# Altium schematic sheet switches.SchDoc
size D
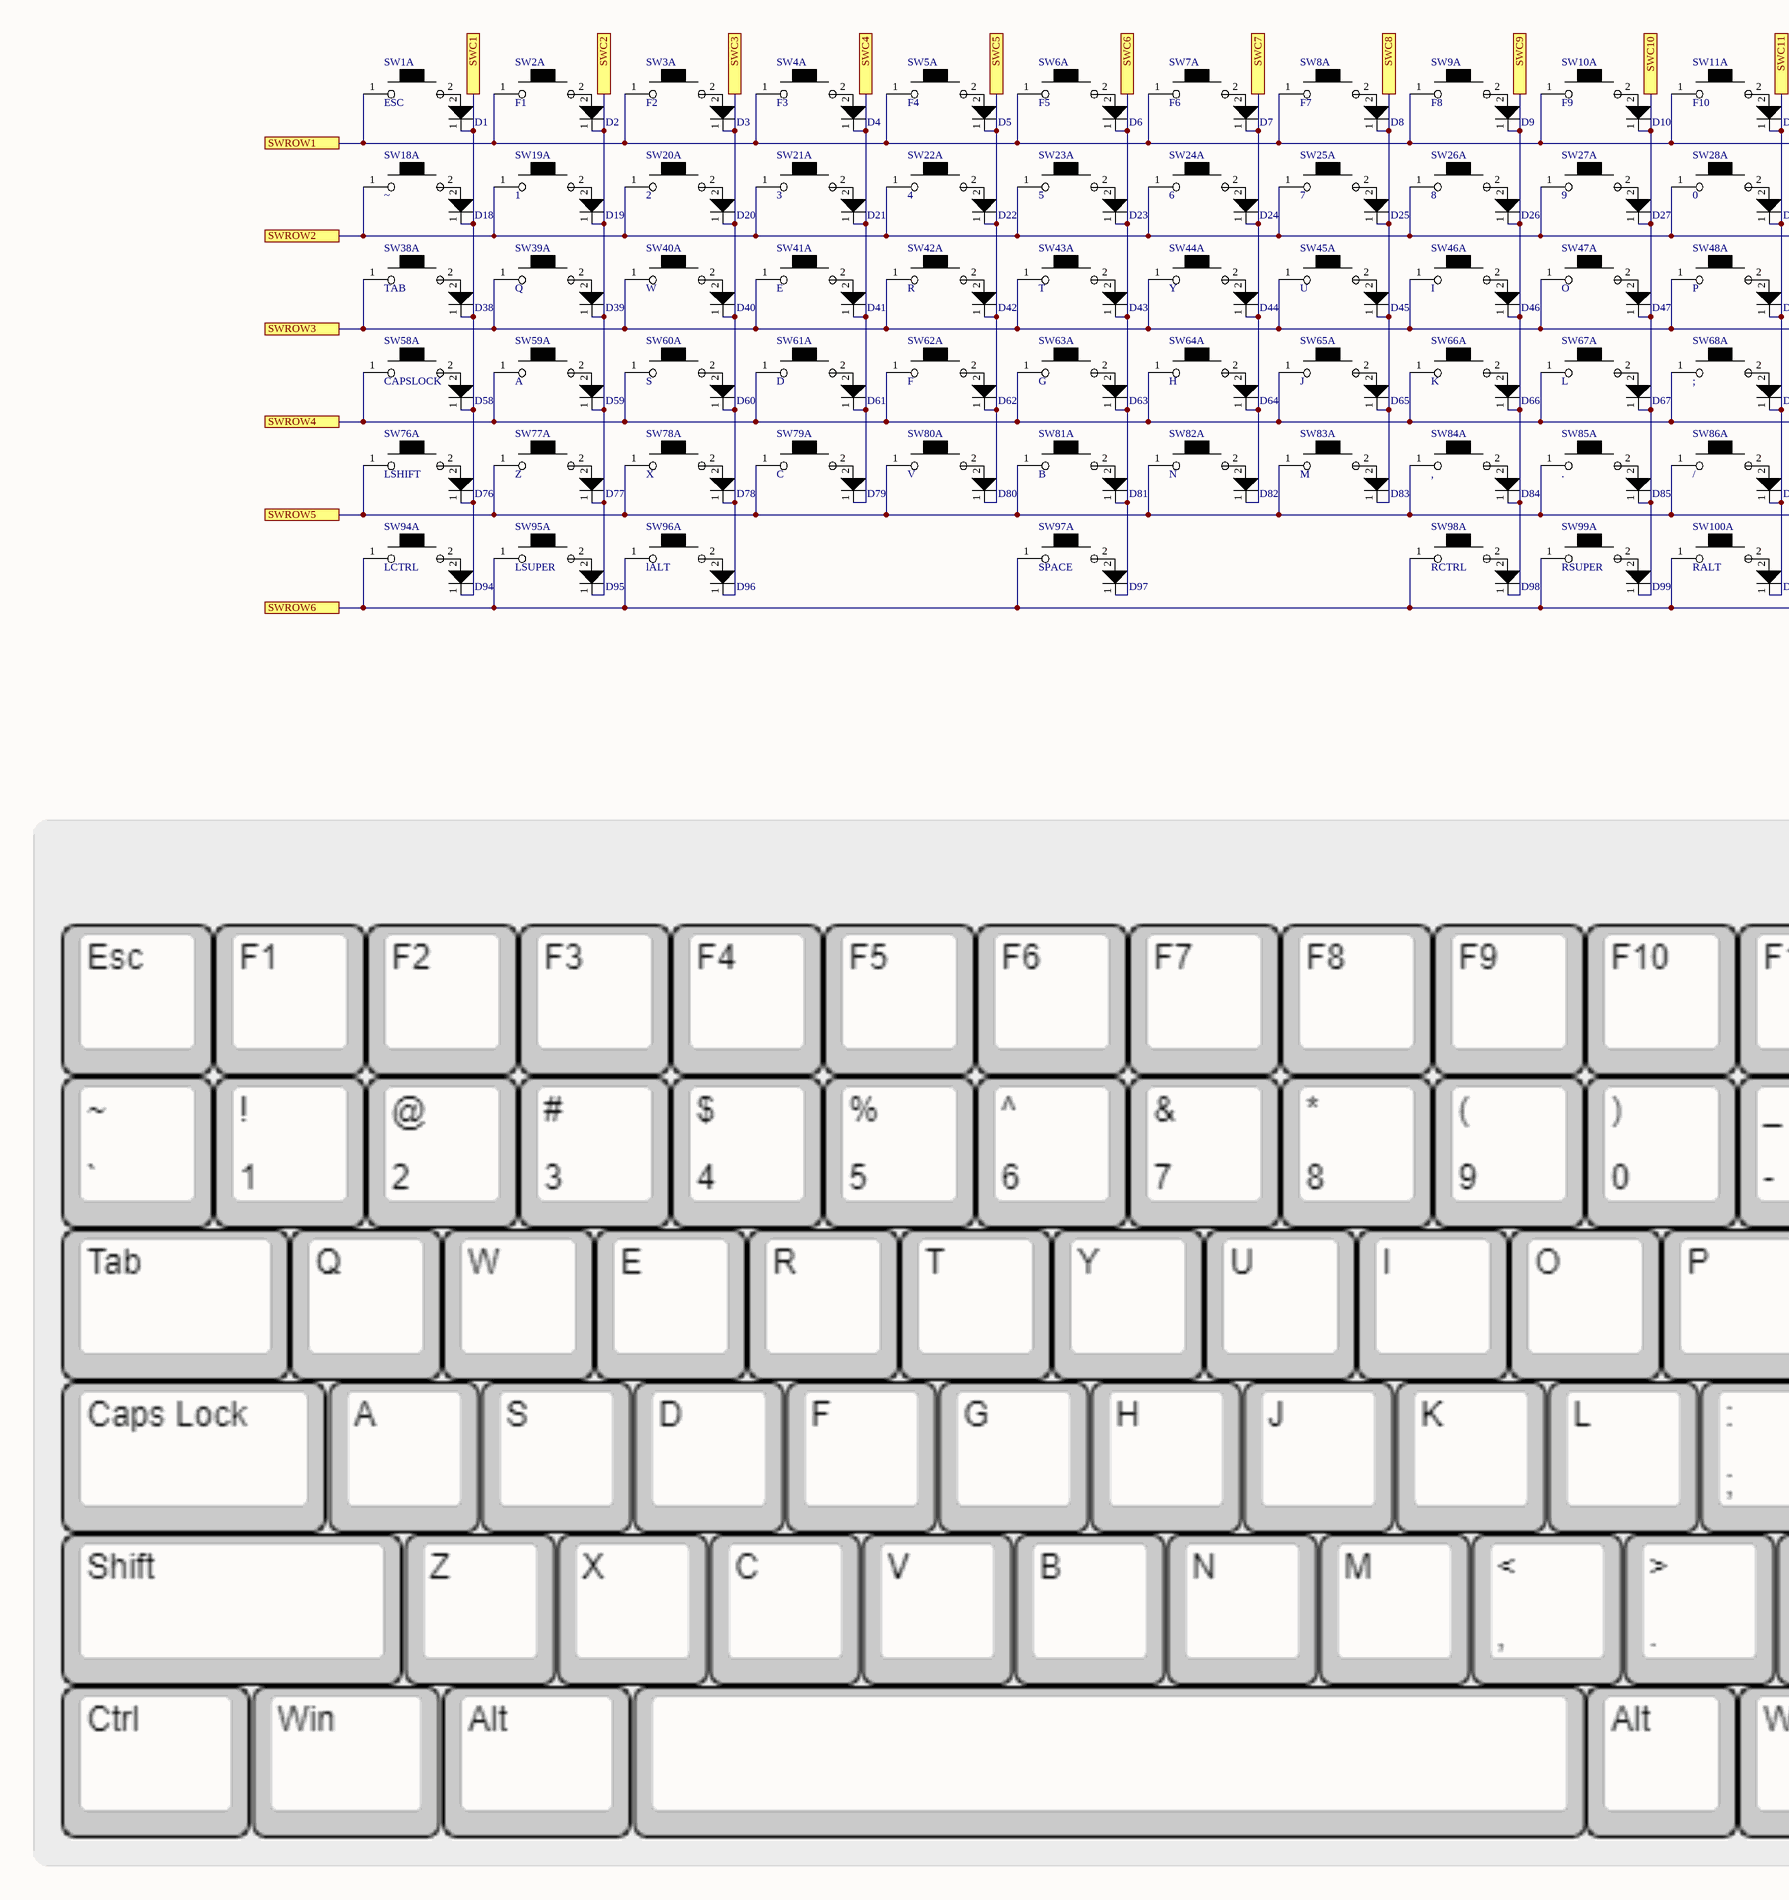
[diagram p0: switches.SchDoc, left]
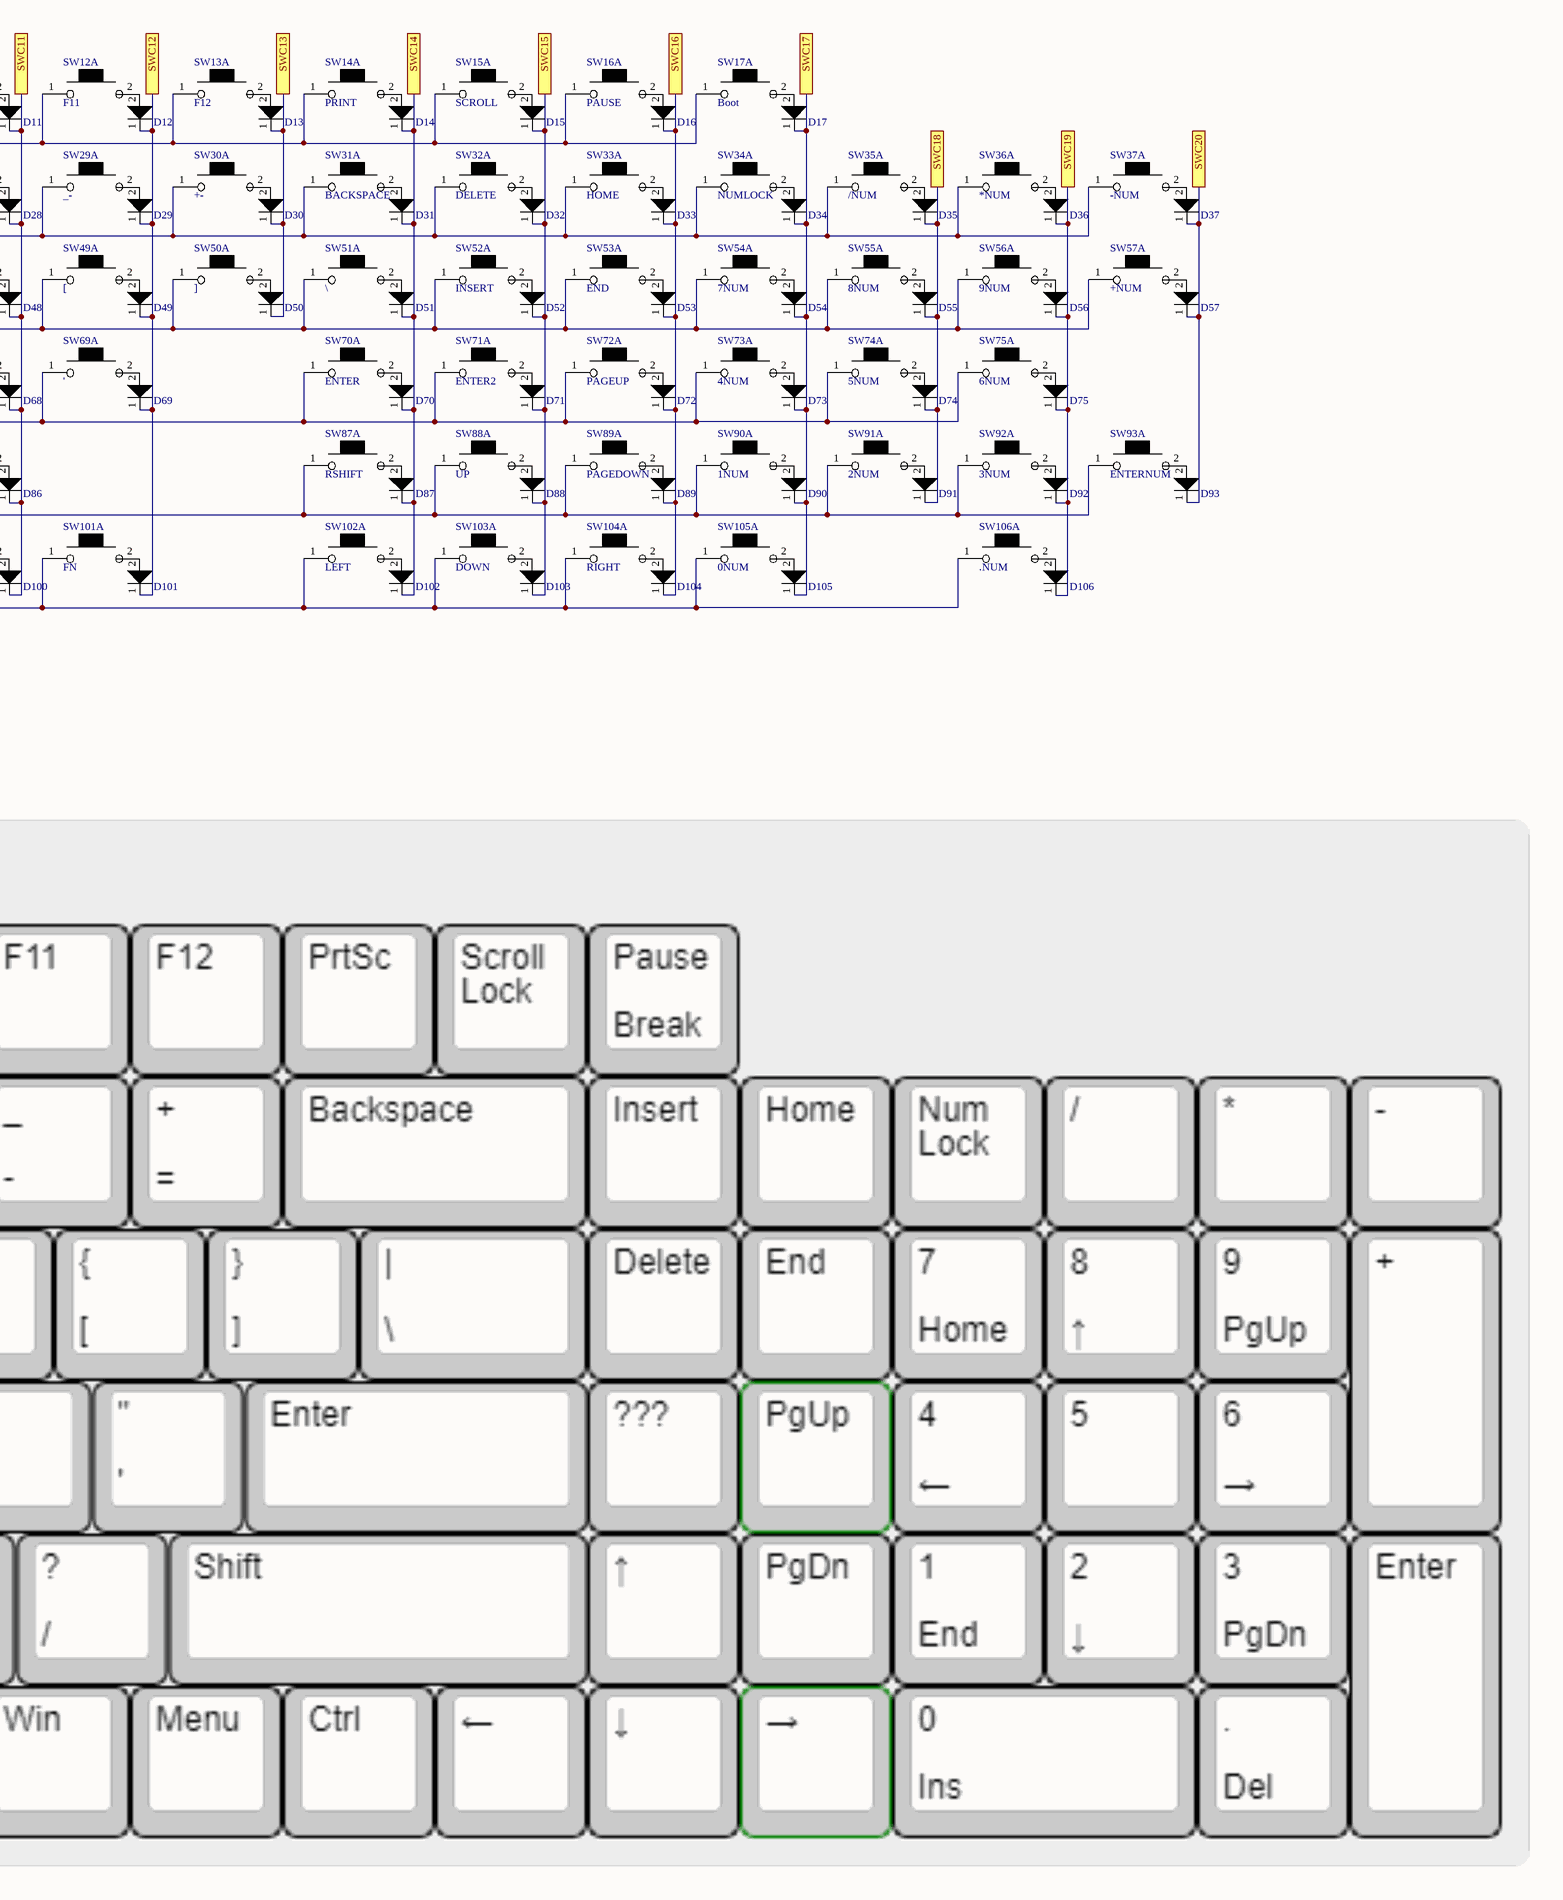
[diagram p1: switches.SchDoc, right]

## Parts
D1  1N4148WTR  [SOD-123]  (value not drawn)
D2  1N4148WTR  [SOD-123]  (value not drawn)
D3  1N4148WTR  [SOD-123]  (value not drawn)
D4  1N4148WTR  [SOD-123]  (value not drawn)
D5  1N4148WTR  [SOD-123]  (value not drawn)
D6  1N4148WTR  [SOD-123]  (value not drawn)
D7  1N4148WTR  [SOD-123]  (value not drawn)
D8  1N4148WTR  [SOD-123]  (value not drawn)
D9  1N4148WTR  [SOD-123]  (value not drawn)
D10  1N4148WTR  [SOD-123]  (value not drawn)
D11  1N4148WTR  [SOD-123]  (value not drawn)
D12  1N4148WTR  [SOD-123]  (value not drawn)
D13  1N4148WTR  [SOD-123]  (value not drawn)
D14  1N4148WTR  [SOD-123]  (value not drawn)
D15  1N4148WTR  [SOD-123]  (value not drawn)
D16  1N4148WTR  [SOD-123]  (value not drawn)
D17  1N4148WTR  [SOD-123]  (value not drawn)
D18  1N4148WTR  [SOD-123]  (value not drawn)
D19  1N4148WTR  [SOD-123]  (value not drawn)
D20  1N4148WTR  [SOD-123]  (value not drawn)
D21  1N4148WTR  [SOD-123]  (value not drawn)
D22  1N4148WTR  [SOD-123]  (value not drawn)
D23  1N4148WTR  [SOD-123]  (value not drawn)
D24  1N4148WTR  [SOD-123]  (value not drawn)
D25  1N4148WTR  [SOD-123]  (value not drawn)
D26  1N4148WTR  [SOD-123]  (value not drawn)
D27  1N4148WTR  [SOD-123]  (value not drawn)
D28  1N4148WTR  [SOD-123]  (value not drawn)
D29  1N4148WTR  [SOD-123]  (value not drawn)
D30  1N4148WTR  [SOD-123]  (value not drawn)
D31  1N4148WTR  [SOD-123]  (value not drawn)
D32  1N4148WTR  [SOD-123]  (value not drawn)
D33  1N4148WTR  [SOD-123]  (value not drawn)
D34  1N4148WTR  [SOD-123]  (value not drawn)
D35  1N4148WTR  [SOD-123]  (value not drawn)
D36  1N4148WTR  [SOD-123]  (value not drawn)
D37  1N4148WTR  [SOD-123]  (value not drawn)
D38  1N4148WTR  [SOD-123]  (value not drawn)
D39  1N4148WTR  [SOD-123]  (value not drawn)
D40  1N4148WTR  [SOD-123]  (value not drawn)
D41  1N4148WTR  [SOD-123]  (value not drawn)
D42  1N4148WTR  [SOD-123]  (value not drawn)
D43  1N4148WTR  [SOD-123]  (value not drawn)
D44  1N4148WTR  [SOD-123]  (value not drawn)
D45  1N4148WTR  [SOD-123]  (value not drawn)
D46  1N4148WTR  [SOD-123]  (value not drawn)
D47  1N4148WTR  [SOD-123]  (value not drawn)
D48  1N4148WTR  [SOD-123]  (value not drawn)
D49  1N4148WTR  [SOD-123]  (value not drawn)
D50  1N4148WTR  [SOD-123]  (value not drawn)
D51  1N4148WTR  [SOD-123]  (value not drawn)
D52  1N4148WTR  [SOD-123]  (value not drawn)
D53  1N4148WTR  [SOD-123]  (value not drawn)
D54  1N4148WTR  [SOD-123]  (value not drawn)
D55  1N4148WTR  [SOD-123]  (value not drawn)
D56  1N4148WTR  [SOD-123]  (value not drawn)
D57  1N4148WTR  [SOD-123]  (value not drawn)
D58  1N4148WTR  [SOD-123]  (value not drawn)
D59  1N4148WTR  [SOD-123]  (value not drawn)
D60  1N4148WTR  [SOD-123]  (value not drawn)
D61  1N4148WTR  [SOD-123]  (value not drawn)
D62  1N4148WTR  [SOD-123]  (value not drawn)
D63  1N4148WTR  [SOD-123]  (value not drawn)
D64  1N4148WTR  [SOD-123]  (value not drawn)
D65  1N4148WTR  [SOD-123]  (value not drawn)
D66  1N4148WTR  [SOD-123]  (value not drawn)
D67  1N4148WTR  [SOD-123]  (value not drawn)
D68  1N4148WTR  [SOD-123]  (value not drawn)
D69  1N4148WTR  [SOD-123]  (value not drawn)
D70  1N4148WTR  [SOD-123]  (value not drawn)
D71  1N4148WTR  [SOD-123]  (value not drawn)
D72  1N4148WTR  [SOD-123]  (value not drawn)
D73  1N4148WTR  [SOD-123]  (value not drawn)
D74  1N4148WTR  [SOD-123]  (value not drawn)
D75  1N4148WTR  [SOD-123]  (value not drawn)
D76  1N4148WTR  [SOD-123]  (value not drawn)
D77  1N4148WTR  [SOD-123]  (value not drawn)
D78  1N4148WTR  [SOD-123]  (value not drawn)
D79  1N4148WTR  [SOD-123]  (value not drawn)
D80  1N4148WTR  [SOD-123]  (value not drawn)
D81  1N4148WTR  [SOD-123]  (value not drawn)
D82  1N4148WTR  [SOD-123]  (value not drawn)
D83  1N4148WTR  [SOD-123]  (value not drawn)
D84  1N4148WTR  [SOD-123]  (value not drawn)
D85  1N4148WTR  [SOD-123]  (value not drawn)
D86  1N4148WTR  [SOD-123]  (value not drawn)
D87  1N4148WTR  [SOD-123]  (value not drawn)
D88  1N4148WTR  [SOD-123]  (value not drawn)
D89  1N4148WTR  [SOD-123]  (value not drawn)
D90  1N4148WTR  [SOD-123]  (value not drawn)
D91  1N4148WTR  [SOD-123]  (value not drawn)
D92  1N4148WTR  [SOD-123]  (value not drawn)
D93  1N4148WTR  [SOD-123]  (value not drawn)
D94  1N4148WTR  [SOD-123]  (value not drawn)
D95  1N4148WTR  [SOD-123]  (value not drawn)
D96  1N4148WTR  [SOD-123]  (value not drawn)
D97  1N4148WTR  [SOD-123]  (value not drawn)
D98  1N4148WTR  [SOD-123]  (value not drawn)
D99  1N4148WTR  [SOD-123]  (value not drawn)
D100  1N4148WTR  [SOD-123]  (value not drawn)
D101  1N4148WTR  [SOD-123]  (value not drawn)
D102  1N4148WTR  [SOD-123]  (value not drawn)
D103  1N4148WTR  [SOD-123]  (value not drawn)
D104  1N4148WTR  [SOD-123]  (value not drawn)
D105  1N4148WTR  [SOD-123]  (value not drawn)
D106  1N4148WTR  [SOD-123]  (value not drawn)
SW1  ESC  [SWITCH_U1_W_LED]  (part A of 2)
SW2  F1  [SWITCH_U1_W_LED]  (part A of 2)
SW3  F2  [SWITCH_U1_W_LED]  (part A of 2)
SW4  F3  [SWITCH_U1_W_LED]  (part A of 2)
SW5  F4  [SWITCH_U1_W_LED]  (part A of 2)
SW6  F5  [SWITCH_U1_W_LED]  (part A of 2)
SW7  F6  [SWITCH_U1_W_LED]  (part A of 2)
SW8  F7  [SWITCH_U1_W_LED]  (part A of 2)
SW9  F8  [SWITCH_U1_W_LED]  (part A of 2)
SW10  F9  [SWITCH_U1_W_LED]  (part A of 2)
SW11  F10  [SWITCH_U1_W_LED]  (part A of 2)
SW12  F11  [SWITCH_U1_W_LED]  (part A of 2)
SW13  F12  [SWITCH_U1_W_LED]  (part A of 2)
SW14  PRINT  [SWITCH_U1_W_LED]  (part A of 2)
SW15  SCROLL  [SWITCH_U1_W_LED]  (part A of 2)
SW16  PAUSE  [SWITCH_U1_W_LED]  (part A of 2)
SW17  Boot  [SWITCH_U1_W_LED]  (part A of 2)
SW18  ~  [SWITCH_U1_W_LED]  (part A of 2)
SW19  1  [SWITCH_U1_W_LED]  (part A of 2)
SW20  2  [SWITCH_U1_W_LED]  (part A of 2)
SW21  3  [SWITCH_U1_W_LED]  (part A of 2)
SW22  4  [SWITCH_U1_W_LED]  (part A of 2)
SW23  5  [SWITCH_U1_W_LED]  (part A of 2)
SW24  6  [SWITCH_U1_W_LED]  (part A of 2)
SW25  7  [SWITCH_U1_W_LED]  (part A of 2)
SW26  8  [SWITCH_U1_W_LED]  (part A of 2)
SW27  9  [SWITCH_U1_W_LED]  (part A of 2)
SW28  0  [SWITCH_U1_W_LED]  (part A of 2)
SW29  _-  [SWITCH_U1_W_LED]  (part A of 2)
SW30  +-  [SWITCH_U1_W_LED]  (part A of 2)
SW31  BACKSPACE  [SWITCH_U2_W_LED]  (part A of 2)
SW32  DELETE  [SWITCH_U1_W_LED]  (part A of 2)
SW33  HOME  [SWITCH_U1_W_LED]  (part A of 2)
SW34  NUMLOCK  [SWITCH_U1_W_LED]  (part A of 2)
SW35  /NUM  [SWITCH_U1_W_LED]  (part A of 2)
SW36  *NUM  [SWITCH_U1_W_LED]  (part A of 2)
SW37  -NUM  [SWITCH_U1_W_LED]  (part A of 2)
SW38  TAB  [SWITCH_U1.50_W_LED]  (part A of 2)
SW39  Q  [SWITCH_U1_W_LED]  (part A of 2)
SW40  W  [SWITCH_U1_W_LED]  (part A of 2)
SW41  E  [SWITCH_U1_W_LED]  (part A of 2)
SW42  R  [SWITCH_U1_W_LED]  (part A of 2)
SW43  T  [SWITCH_U1_W_LED]  (part A of 2)
SW44  Y  [SWITCH_U1_W_LED]  (part A of 2)
SW45  U  [SWITCH_U1_W_LED]  (part A of 2)
SW46  I  [SWITCH_U1_W_LED]  (part A of 2)
SW47  O  [SWITCH_U1_W_LED]  (part A of 2)
SW48  P  [SWITCH_U1_W_LED]  (part A of 2)
SW49  [  [SWITCH_U1_W_LED]  (part A of 2)
SW50  ]  [SWITCH_U1_W_LED]  (part A of 2)
SW51  \  [SWITCH_U1.50_W_LED]  (part A of 2)
SW52  INSERT  [SWITCH_U1_W_LED]  (part A of 2)
SW53  END  [SWITCH_U1_W_LED]  (part A of 2)
SW54  7NUM  [SWITCH_U1_W_LED]  (part A of 2)
SW55  8NUM  [SWITCH_U1_W_LED]  (part A of 2)
SW56  9NUM  [SWITCH_U1_W_LED]  (part A of 2)
SW57  +NUM  [SWITCH_U2_W_LED - vert]  (part A of 2)
SW58  CAPSLOCK  [SWITCH_U1.75_W_LED]  (part A of 2)
SW59  A  [SWITCH_U1_W_LED]  (part A of 2)
SW60  S  [SWITCH_U1_W_LED]  (part A of 2)
SW61  D  [SWITCH_U1_W_LED]  (part A of 2)
SW62  F  [SWITCH_U1_W_LED]  (part A of 2)
SW63  G  [SWITCH_U1_W_LED]  (part A of 2)
SW64  H  [SWITCH_U1_W_LED]  (part A of 2)
SW65  J  [SWITCH_U1_W_LED]  (part A of 2)
SW66  K  [SWITCH_U1_W_LED]  (part A of 2)
SW67  L  [SWITCH_U1_W_LED]  (part A of 2)
SW68  ;  [SWITCH_U1_W_LED]  (part A of 2)
SW69  '  [SWITCH_U1_W_LED]  (part A of 2)
SW70  ENTER  [SWITCH_U2.25_W_LED]  (part A of 2)
SW71  ENTER2  [SWITCH_U1_W_LED]  (part A of 2)
SW72  PAGEUP  [SWITCH_U1_W_LED]  (part A of 2)
SW73  4NUM  [SWITCH_U1_W_LED]  (part A of 2)
SW74  5NUM  [SWITCH_U1_W_LED]  (part A of 2)
SW75  6NUM  [SWITCH_U1_W_LED]  (part A of 2)
SW76  LSHIFT  [SWITCH_U2.25_W_LED]  (part A of 2)
SW77  Z  [SWITCH_U1_W_LED]  (part A of 2)
SW78  X  [SWITCH_U1_W_LED]  (part A of 2)
SW79  C  [SWITCH_U1_W_LED]  (part A of 2)
SW80  V  [SWITCH_U1_W_LED]  (part A of 2)
SW81  B  [SWITCH_U1_W_LED]  (part A of 2)
SW82  N  [SWITCH_U1_W_LED]  (part A of 2)
SW83  M  [SWITCH_U1_W_LED]  (part A of 2)
SW84  ,  [SWITCH_U1_W_LED]  (part A of 2)
SW85  .  [SWITCH_U1_W_LED]  (part A of 2)
SW86  /  [SWITCH_U1_W_LED]  (part A of 2)
SW87  RSHIFT  [SWITCH_U2.75_W_LED]  (part A of 2)
SW88  UP  [SWITCH_U1_W_LED]  (part A of 2)
SW89  PAGEDOWN  [SWITCH_U1_W_LED]  (part A of 2)
SW90  1NUM  [SWITCH_U1_W_LED]  (part A of 2)
SW91  2NUM  [SWITCH_U1_W_LED]  (part A of 2)
SW92  3NUM  [SWITCH_U1_W_LED]  (part A of 2)
SW93  ENTERNUM  [SWITCH_U2_W_LED - vert]  (part A of 2)
SW94  LCTRL  [SWITCH_U1.25_W_LED]  (part A of 2)
SW95  LSUPER  [SWITCH_U1.25_W_LED]  (part A of 2)
SW96  lALT  [SWITCH_U1.25_W_LED]  (part A of 2)
SW97  SPACE  [SWITCH_U6.25_W_LED - duplicate]  (part A of 2)
SW98  RCTRL  [SWITCH_U1_W_LED]  (part A of 2)
SW99  RSUPER  [SWITCH_U1_W_LED]  (part A of 2)
SW100  RALT  [SWITCH_U1_W_LED]  (part A of 2)
SW101  FN  [SWITCH_U1_W_LED]  (part A of 2)
SW102  LEFT  [SWITCH_U1_W_LED]  (part A of 2)
SW103  DOWN  [SWITCH_U1_W_LED]  (part A of 2)
SW104  RIGHT  [SWITCH_U1_W_LED]  (part A of 2)
SW105  0NUM  [SWITCH_U2_W_LED]  (part A of 2)
SW106  .NUM  [SWITCH_U1_W_LED]  (part A of 2)

## Ports
SWC1, SWC2, SWC3, SWC4, SWC5, SWC6, SWC7, SWC8, SWC9, SWC10, SWC11, SWC12, SWC13, SWC14, SWC15, SWC16, SWC17, SWC18, SWC19, SWC20, SWROW1, SWROW2, SWROW3, SWROW4, SWROW5, SWROW6

## Nets
SWC1: D1.1 D18.1 D38.1 D58.1 D76.1 D94.1 ; port SWC1
SWC2: D2.1 D19.1 D39.1 D59.1 D77.1 D95.1 ; port SWC2
SWC3: D3.1 D20.1 D40.1 D60.1 D78.1 D96.1 ; port SWC3
SWC4: D4.1 D21.1 D41.1 D61.1 D79.1 ; port SWC4
SWC5: D5.1 D22.1 D42.1 D62.1 D80.1 ; port SWC5
SWC6: D6.1 D23.1 D43.1 D63.1 D81.1 D97.1 ; port SWC6
SWC7: D7.1 D24.1 D44.1 D64.1 D82.1 ; port SWC7
SWC8: D8.1 D25.1 D45.1 D65.1 D83.1 ; port SWC8
SWC9: D9.1 D26.1 D46.1 D66.1 D84.1 D98.1 ; port SWC9
SWC10: D10.1 D27.1 D47.1 D67.1 D85.1 D99.1 ; port SWC10
SWC11: D11.1 D28.1 D48.1 D68.1 D86.1 D100.1 ; port SWC11
SWC12: D12.1 D29.1 D49.1 D69.1 D101.1 ; port SWC12
SWC13: D13.1 D30.1 D50.1 ; port SWC13
SWC14: D14.1 D31.1 D51.1 D70.1 D87.1 D102.1 ; port SWC14
SWC15: D15.1 D32.1 D52.1 D71.1 D88.1 D103.1 ; port SWC15
SWC16: D16.1 D33.1 D53.1 D72.1 D89.1 D104.1 ; port SWC16
SWC17: D17.1 D34.1 D54.1 D73.1 D90.1 D105.1 ; port SWC17
SWC18: D35.1 D55.1 D74.1 D91.1 ; port SWC18
SWC19: D36.1 D56.1 D75.1 D92.1 D106.1 ; port SWC19
SWC20: D37.1 D57.1 D93.1 ; port SWC20
SWROW1: SW1.1 SW2.1 SW3.1 SW4.1 SW5.1 SW6.1 SW7.1 SW8.1 SW9.1 SW10.1 SW11.1 SW12.1 SW13.1 SW14.1 SW15.1 SW16.1 SW17.1 ; port SWROW1
SWROW2: SW18.1 SW19.1 SW20.1 SW21.1 SW22.1 SW23.1 SW24.1 SW25.1 SW26.1 SW27.1 SW28.1 SW29.1 SW30.1 SW31.1 SW32.1 SW33.1 SW34.1 SW35.1 SW36.1 SW37.1 ; port SWROW2
SWROW3: SW38.1 SW39.1 SW40.1 SW41.1 SW42.1 SW43.1 SW44.1 SW45.1 SW46.1 SW47.1 SW48.1 SW49.1 SW50.1 SW51.1 SW52.1 SW53.1 SW54.1 SW55.1 SW56.1 SW57.1 ; port SWROW3
SWROW4: SW58.1 SW59.1 SW60.1 SW61.1 SW62.1 SW63.1 SW64.1 SW65.1 SW66.1 SW67.1 SW68.1 SW69.1 SW70.1 SW71.1 SW72.1 SW73.1 SW74.1 SW75.1 ; port SWROW4
SWROW5: SW76.1 SW77.1 SW78.1 SW79.1 SW80.1 SW81.1 SW82.1 SW83.1 SW84.1 SW85.1 SW86.1 SW87.1 SW88.1 SW89.1 SW90.1 SW91.1 SW92.1 SW93.1 ; port SWROW5
SWROW6: SW94.1 SW95.1 SW96.1 SW97.1 SW98.1 SW99.1 SW100.1 SW101.1 SW102.1 SW103.1 SW104.1 SW105.1 SW106.1 ; port SWROW6
NetD1_2: D1.2 SW1.2
NetD2_2: D2.2 SW2.2
NetD3_2: D3.2 SW3.2
NetD4_2: D4.2 SW4.2
NetD5_2: D5.2 SW5.2
NetD6_2: D6.2 SW6.2
NetD7_2: D7.2 SW7.2
NetD8_2: D8.2 SW8.2
NetD9_2: D9.2 SW9.2
NetD10_2: D10.2 SW10.2
NetD11_2: D11.2 SW11.2
NetD12_2: D12.2 SW12.2
NetD13_2: D13.2 SW13.2
NetD14_2: D14.2 SW14.2
NetD15_2: D15.2 SW15.2
NetD16_2: D16.2 SW16.2
NetD17_2: D17.2 SW17.2
NetD18_2: D18.2 SW18.2
NetD19_2: D19.2 SW19.2
NetD20_2: D20.2 SW20.2
NetD21_2: D21.2 SW21.2
NetD22_2: D22.2 SW22.2
NetD23_2: D23.2 SW23.2
NetD24_2: D24.2 SW24.2
NetD25_2: D25.2 SW25.2
NetD26_2: D26.2 SW26.2
NetD27_2: D27.2 SW27.2
NetD28_2: D28.2 SW28.2
NetD29_2: D29.2 SW29.2
NetD30_2: D30.2 SW30.2
NetD31_2: D31.2 SW31.2
NetD32_2: D32.2 SW32.2
NetD33_2: D33.2 SW33.2
NetD34_2: D34.2 SW34.2
NetD35_2: D35.2 SW35.2
NetD36_2: D36.2 SW36.2
NetD37_2: D37.2 SW37.2
NetD38_2: D38.2 SW38.2
NetD39_2: D39.2 SW39.2
NetD40_2: D40.2 SW40.2
NetD41_2: D41.2 SW41.2
NetD42_2: D42.2 SW42.2
NetD43_2: D43.2 SW43.2
NetD44_2: D44.2 SW44.2
NetD45_2: D45.2 SW45.2
NetD46_2: D46.2 SW46.2
NetD47_2: D47.2 SW47.2
NetD48_2: D48.2 SW48.2
NetD49_2: D49.2 SW49.2
NetD50_2: D50.2 SW50.2
NetD51_2: D51.2 SW51.2
NetD52_2: D52.2 SW52.2
NetD53_2: D53.2 SW53.2
NetD54_2: D54.2 SW54.2
NetD55_2: D55.2 SW55.2
NetD56_2: D56.2 SW56.2
NetD57_2: D57.2 SW57.2
NetD58_2: D58.2 SW58.2
NetD59_2: D59.2 SW59.2
NetD60_2: D60.2 SW60.2
NetD61_2: D61.2 SW61.2
NetD62_2: D62.2 SW62.2
NetD63_2: D63.2 SW63.2
NetD64_2: D64.2 SW64.2
NetD65_2: D65.2 SW65.2
NetD66_2: D66.2 SW66.2
NetD67_2: D67.2 SW67.2
NetD68_2: D68.2 SW68.2
NetD69_2: D69.2 SW69.2
NetD70_2: D70.2 SW70.2
NetD71_2: D71.2 SW71.2
NetD72_2: D72.2 SW72.2
NetD73_2: D73.2 SW73.2
NetD74_2: D74.2 SW74.2
NetD75_2: D75.2 SW75.2
NetD76_2: D76.2 SW76.2
NetD77_2: D77.2 SW77.2
NetD78_2: D78.2 SW78.2
NetD79_2: D79.2 SW79.2
NetD80_2: D80.2 SW80.2
NetD81_2: D81.2 SW81.2
NetD82_2: D82.2 SW82.2
NetD83_2: D83.2 SW83.2
NetD84_2: D84.2 SW84.2
NetD85_2: D85.2 SW85.2
NetD86_2: D86.2 SW86.2
NetD87_2: D87.2 SW87.2
NetD88_2: D88.2 SW88.2
NetD89_2: D89.2 SW89.2
NetD90_2: D90.2 SW90.2
NetD91_2: D91.2 SW91.2
NetD92_2: D92.2 SW92.2
NetD93_2: D93.2 SW93.2
NetD94_2: D94.2 SW94.2
NetD95_2: D95.2 SW95.2
NetD96_2: D96.2 SW96.2
NetD97_2: D97.2 SW97.2
NetD98_2: D98.2 SW98.2
NetD99_2: D99.2 SW99.2
NetD100_2: D100.2 SW100.2
NetD101_2: D101.2 SW101.2
NetD102_2: D102.2 SW102.2
NetD103_2: D103.2 SW103.2
NetD104_2: D104.2 SW104.2
NetD105_2: D105.2 SW105.2
NetD106_2: D106.2 SW106.2

## Notes on the sheet
- Title
- Size:
- Date:
- File:
- D
- Number:
- Time:
- Revision:
- Sheet
- of

## Library data of the parts
SW1-SW106 = MX_SWITCH_SINGLE_W_SMD_LED: Supplier 1: Mouser; Supplier Part Number 1: 630-ASMB-MTB0-0A3A2
D1-D106 = 1N4148WTR: Supplier 1: Digi-Key; Supplier Part Number 1: 1655-1360-1-ND